# Altium schematic sheet Motor_Module.SchDoc: Название схемы
size 420 x 297 mm; ApprovedBy: Человек 1; CheckedBy: Человек 3; Author: Человек 2; DrawnBy: Человек; DocumentNumber: АЕСН.ХХХХХХ.ХХХЭ3; SheetNumber: x; SheetTotal: x; DocumentName: Sheet1.SCHDOC
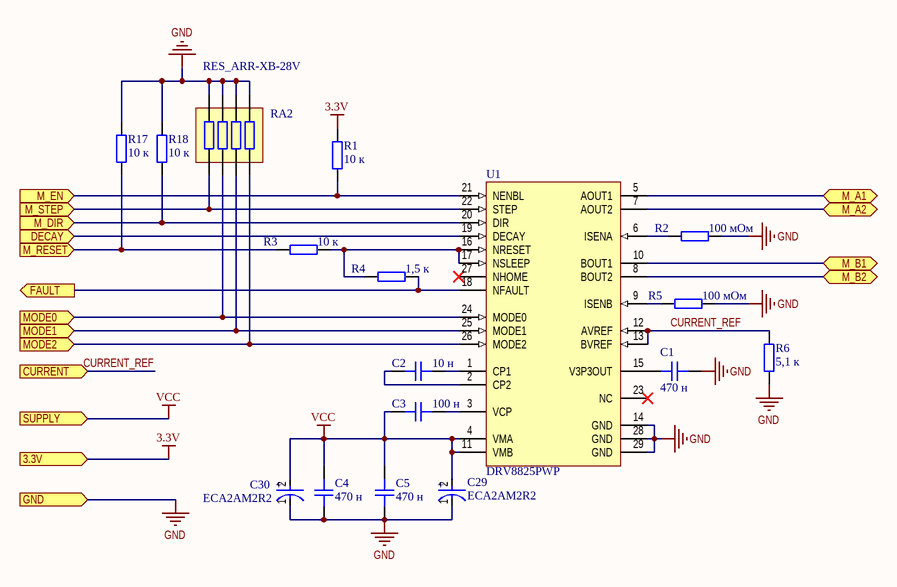
[diagram p0: Motor_Module.SchDoc]

## Parts
C1  470 н  [CAP_0603]
C2  10 н  [CAP_0603]
C3  100 н  [CAP_0603]
C4  470 н  [CAP_0805]
C5  470 н  [CAP_0805]
C29  ECA2AM2R2  [FP-RAD-TH-D_5_0_5-L_11_1-MFG]
C30  ECA2AM2R2  [FP-RAD-TH-D_5_0_5-L_11_1-MFG]
R1  10 к  [RES_0603]
R2  100 мОм  [RES_1206]
R3  10 к  [RES_0603]
R4  1,5 к  [RES_0603]
R5  100 мОм  [RES_1206]
R6  5,1 к  [RES_0603]
R17  10 к  [RES_0603]
R18  10 к  [RES_0603]
RA2  RES_ARR-XB-28V  [EXB-28V]
U1  DRV8825PWP  [PWP0028C_L]

## Ports
3.3V (in), CURRENT (in), DECAY (in), FAULT (out), GND (in), M_A1 (bidir), M_A2 (bidir), M_B1 (bidir), M_B2 (bidir), M_DIR (in), M_EN (in), M_RESET (in), M_STEP (in), MODE0 (in), MODE1 (in), MODE2 (in), SUPPLY (in)

## Nets
3.3V: R1.1 ; port 3.3V
GND: C1.2 C4.2 C5.2 C29.1(C) C30.1(C) R2.2 R5.2 R6.2 R17.1 R18.1 RA2.5 RA2.6 RA2.7 RA2.8 U1.14(GND) U1.28(GND) U1.29(GND) ; port GND
VCC: C3.1 C4.1 C5.1 C29.2(A) C30.2(A) U1.4(VMA) U1.11(VMB) ; port SUPPLY
CURRENT_REF: R6.1 U1.12(AVREF) U1.13(BVREF) ; port CURRENT
DECAY: U1.19(DECAY) ; port DECAY
FAULT: R4.1 U1.18(NFAULT) ; port FAULT
M_A1: U1.5(AOUT1) ; port M_A1
M_A2: U1.7(AOUT2) ; port M_A2
M_B1: U1.10(BOUT1) ; port M_B1
M_B2: U1.8(BOUT2) ; port M_B2
M_DIR: R18.2 U1.20(DIR) ; port M_DIR
M_EN: R1.2 U1.21(NENBL) ; port M_EN
M_RESET: R3.2 R17.2 ; port M_RESET
M_STEP: RA2.4 U1.22(STEP) ; port M_STEP
MODE0: RA2.3 U1.24(MODE0) ; port MODE0
MODE1: RA2.2 U1.25(MODE1) ; port MODE1
MODE2: RA2.1 U1.26(MODE2) ; port MODE2
NetC1_1: C1.1 U1.15(V3P3OUT)
NetC2_1: C2.1 U1.1(CP1)
NetC2_2: C2.2 U1.2(CP2)
NetC3_2: C3.2 U1.3(VCP)
NetR2_1: R2.1 U1.6(ISENA)
NetR3_1: R3.1 R4.2 U1.16(NRESET) U1.17(NSLEEP)
NetR5_1: R5.1 U1.9(ISENB)

Not connected (* = marked no-connect by the designer): U1 23(NC)* 27(NHOME)*

## Notes on the sheet
- Подп. и дата
- Инв.№ дубл.
- Взам. инв. №
- Инв № подл.
- Изм.
- Лист
- № докум.
- Подп.
- Дата
- Копировал
- Формат А3
- (in symbol CMP-05427-000193-1) +

## Library data of the parts
C1 C2 = CAP_0805: Capacitor SMD 0805; Type: CAP_CERAMIC
  C1: Rating: *; Dielectric: *; Value: 470 н
  C2: Value: 10 н
C3-C5 = CAP_0805: Capacitor SMD 0805; Voltage: 50; Type: CAP_CERAMIC
  C3: Value: 100 н
  C4 C5: Value: 470 н
C29 C30 = CMP-05427-000193-1: Aluminum Electrolytic Capacitors (Radial Lead Type) 2.2uF ±20% 100V; ChipDip: 9000565873; Value: 47 мк; Type: CAP_ELECTROLYTIC; Voltage: 16; Model: JRB1C470M02000500110000B; Mount: THT
R1 R3 R4 R6 R17 R18 = RES_0805: Resistor SMD 0805; Type: RESISTOR
  R1 R3 R17 R18: Value: 10 к
  R4: Value: 1,5 к
  R6: Value: 5,1 к
R2 R5 = RES_1206: Resistor SMD 1206; Value: 100 мОм; Type: RESISTOR
RA2 = RES_ARR-XB-28V: Resistor Array 0402 4 Elements Panasonic EXB-28V; ChipDip: *; Type: *; Mount: *; Value: *; Model: *
U1 = CMP-1685-00019-1: Stepper Motor Controller IC, 8.2 to 45 V, -40 to 85 degC, 28-Pin HTSSOP (PWP), Green (RoHS & no Sb/Br), Tube; ComponentLink2URL: http://www.ti.com/general/docs/lit/getliterature.tsp?genericPartNumber=DRV8825&fileType=pdf; ComponentLink2Description: Datasheet; ComponentLink1Description: Manufacturer URL; ComponentLink1URL: http://www.ti.com/; Model: DRV8825PWP; Type: IC